# EAGLE design Fihl54-xtalOven (EAGLE 7.7.0)
EMNE: xtal ovn; NAVN: OZ1AAB
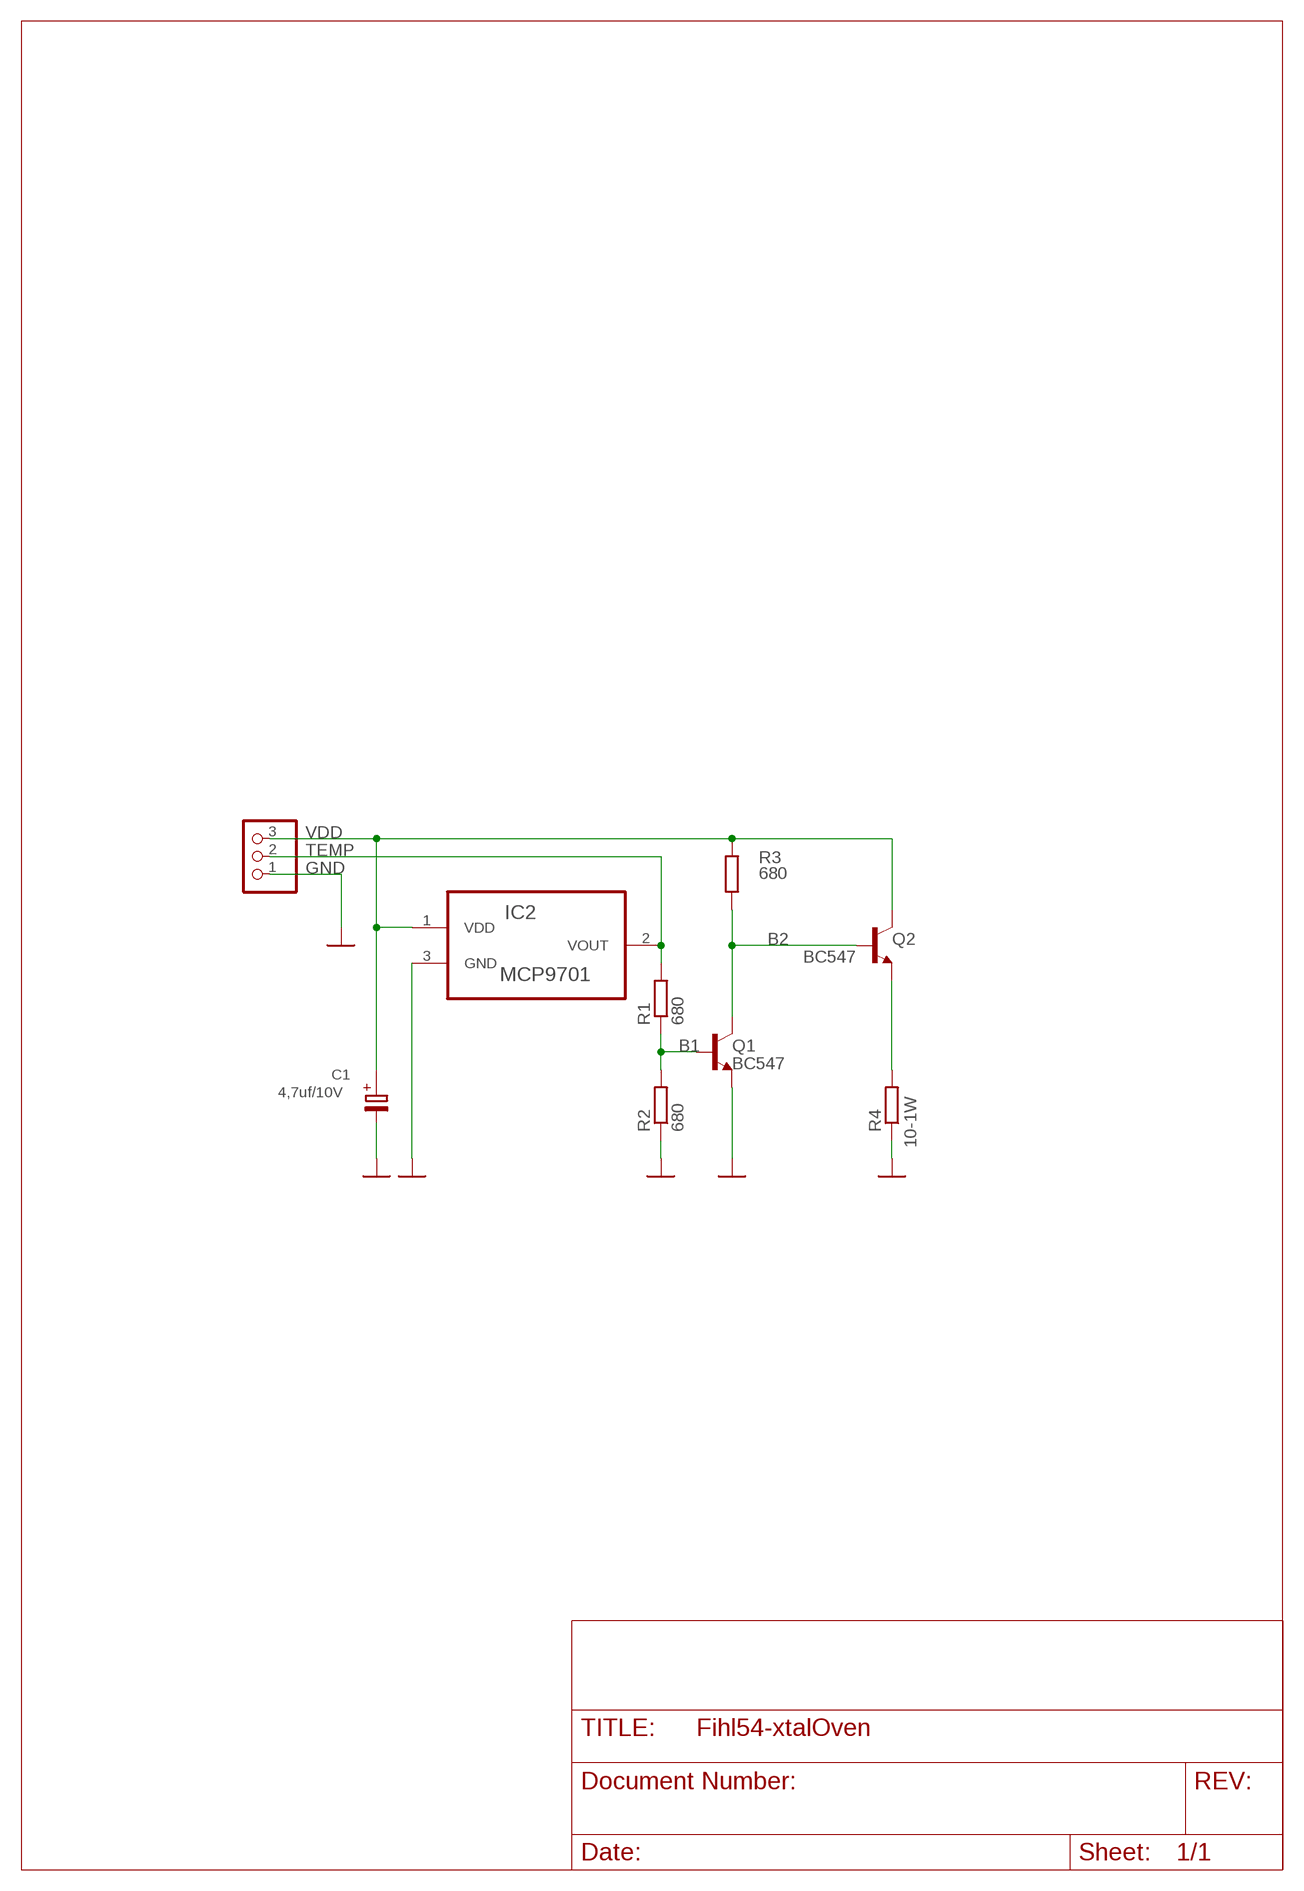
[diagram p0: schematic, sheet 1]

## Parts
C1  4,7uf/10V  E2,5-5  [E2,5-5]
IC2  MCP9701  MCP9701-E/TO  [TO127P254X533-3]
JP1  jp1  PINHD-1X3  [1X03]
Q1  BC547  [TO92]
Q2  BC547  [TO92]
R1  680  R-EU_0309/V  [0309V]
R2  680  R-EU_0309/V  [0309V]
R3  680  R-EU_0309/V  [0309V]
R4  10-1W  R-EU_0309/V  [0309V]

## Nets
B1: Q1.2(B) R1.1 R2.2
B2: Q1.3(C) Q2.2(B) R3.1
E2: Q2.1(E) R4.2
GND: C1.- IC2.3(GND) JP1.1 Q1.1(E) R2.1 R4.1
TEMP: IC2.2(VOUT) JP1.2 R1.2
VDD: C1.+ IC2.1(VDD) JP1.3 Q2.3(C) R3.2

## Library data of the parts
C1 = ELKO:E2,5-5
IC2 = MCP9701-E_TO:MCP9701-E/TO: Check availability <https://pricing.snapeda.com/parts/MCP9701-E/TO/Microchip/view-part?ref=eda>; AVAILABILITY: In Stock; CHECK_PRICES: https://www.snapeda.com/parts/MCP9701-E/TO/Microchip/view-part/?ref=eda; DESCRIPTION: 3 TO-92 4x4mm BAG, Linear Active Thermister (TM) IC (19.53mV/oC) | Microchip Technology Inc. MCP9701-E/TO; MF: Microchip; MP: MCP9701-E/TO; PACKAGE: TO-92 Supertex; PRICE: None; SNAPEDA_LINK: https://www.snapeda.com/parts/MCP9701-E/TO/Microchip/view-part/?ref=snap
JP1 = pinhead:PINHD-1X3: PIN HEADER
Q1 Q2 = transistor-npn:BC547*: NPN Transistor
R1-R4 = rcl:R-EU_: RESISTOR, European symbol

## Net classes
1 supply: width 1.143 mm

## Board
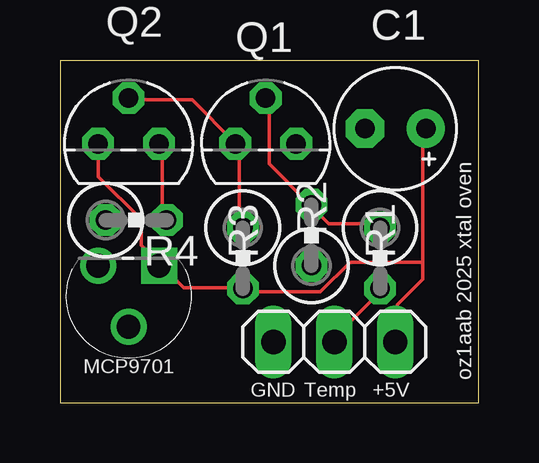
[diagram p1: board, top side]
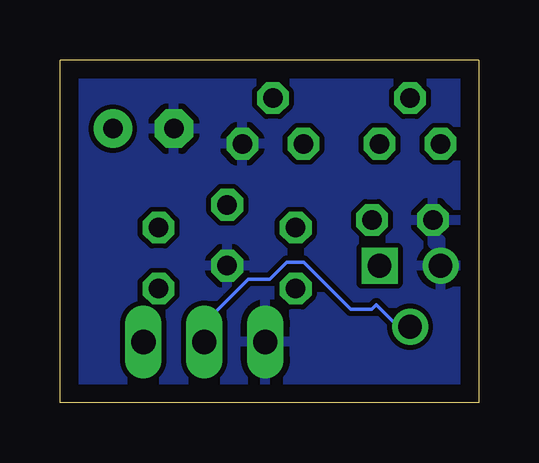
[diagram p2: board, bottom side, seen from below]

Size 17.44 x 14.29 mm. Coordinates in mm from the lower left corner, seen from the top.
Outline: 0,0 17.44,0 17.44,14.29 0,14.29 0,0
Copper layers (1*16): Top 0.035mm / dielectric 1.5mm / Bottom 0.035mm
Design rules "6 mil Badge 2 layer": minimum track width 6mil, minimum drill 19mil, track to track 8mil, track to pad 8mil, pad to pad 8mil, via to via 8mil, smd to smd 6mil, copper to edge 30mil, drill to drill 8mil, minimum pad ring 10mil, minimum via ring 8mil, stop-mask expansion 0mil, vias tented up to drill 0mil, thermal gap 10mil

### Footprints (pad centres in the part's own frame; a part is rotated, then mirrored left to right if it is on the bottom)
E2,5-5 = drill 0.813 pad 1.6: + -1.27,0 | drill 0.813 pad 1.6 octagon: - 1.27,0
TO127P254X533-3 = drill 0.991 square: 1 -2.54,-2.54 | drill 0.991: 2 -1.27,0; 3 0,-2.54
1X03 = drill 1.016 long: 1 -2.54,0; 2 0,0; 3 2.54,0
TO92 = drill 0.813 octagon: 1 1.27,0; 2 0,1.905; 3 -1.27,0
0309V = drill 0.813 octagon: 1 -1.27,0; 2 1.27,0

### Placement (x,y rotation side)
C1  13.97,11.43 180 top
IC2  1.59,3.17 180 top
JP1  11.43,2.54 0 top
Q1  8.57,10.79 0 top
Q2  2.86,10.79 0 top
R1  13.34,6.03 270 top
R2  10.48,6.99 90 top
R3  7.62,6.03 270 top
R4  3.17,7.62 0 top

### Tracks (layer width: path | path; a pad name or v marks a point on that pad's centre or on a via)
B1
  Top 0.152: R1.1 13.34,7.47 11.2,7.47 10.49,8.18 R2.2 10.31,8.36 8.71,9.96 8.71,12.62 Q1.2
B2
  Top 0.152: R3.1 7.47,7.47 7.47,10.67 Q1.3 7.29,10.85 5.51,12.62 3.02,12.62 Q2.2
E2
  Top 0.152: Q2.1 4.27,10.67 4.27,7.82 4.45,7.64 R4.2
GND
  pour Bottom: -0.32,14.61 18.41,14.61 18.41,-0.32 -0.32,-0.32
TEMP
  Top 0.152: R1.2 13.34,4.62 11.38,2.67 JP1.2
  Bottom 0.152: IC2.2 3.02,3.2 3.38,3.2 4.27,4.09 4.45,3.91 5.33,3.91 7.29,5.87 8,5.87 8.71,5.16 9.6,5.16 11.38,3.38 11.38,2.67 JP1.2
VDD
  Top 0.152: 15.11,5.87 15.11,11.38 C1.+ | 15.11,5.87 15.11,5.16 14.05,4.09 14.05,2.67 JP1.3 | Q2.3 1.6,10.67 1.6,9.42 3.38,7.64 3.38,6.58 4.09,5.87 IC2.1 4.27,5.69 5.16,4.8 7.47,4.8 R3.2 7.64,4.62 10.85,4.62 12.09,5.87 15.11,5.87

### Text on the board
tNames: MCP9701 | oz1aab 2025 xtal oven | GND | Temp | +5V